# EAGLE design PowerMeter (EAGLE 9.3.0)
DATABASE: ../../../../digikeydb.txt
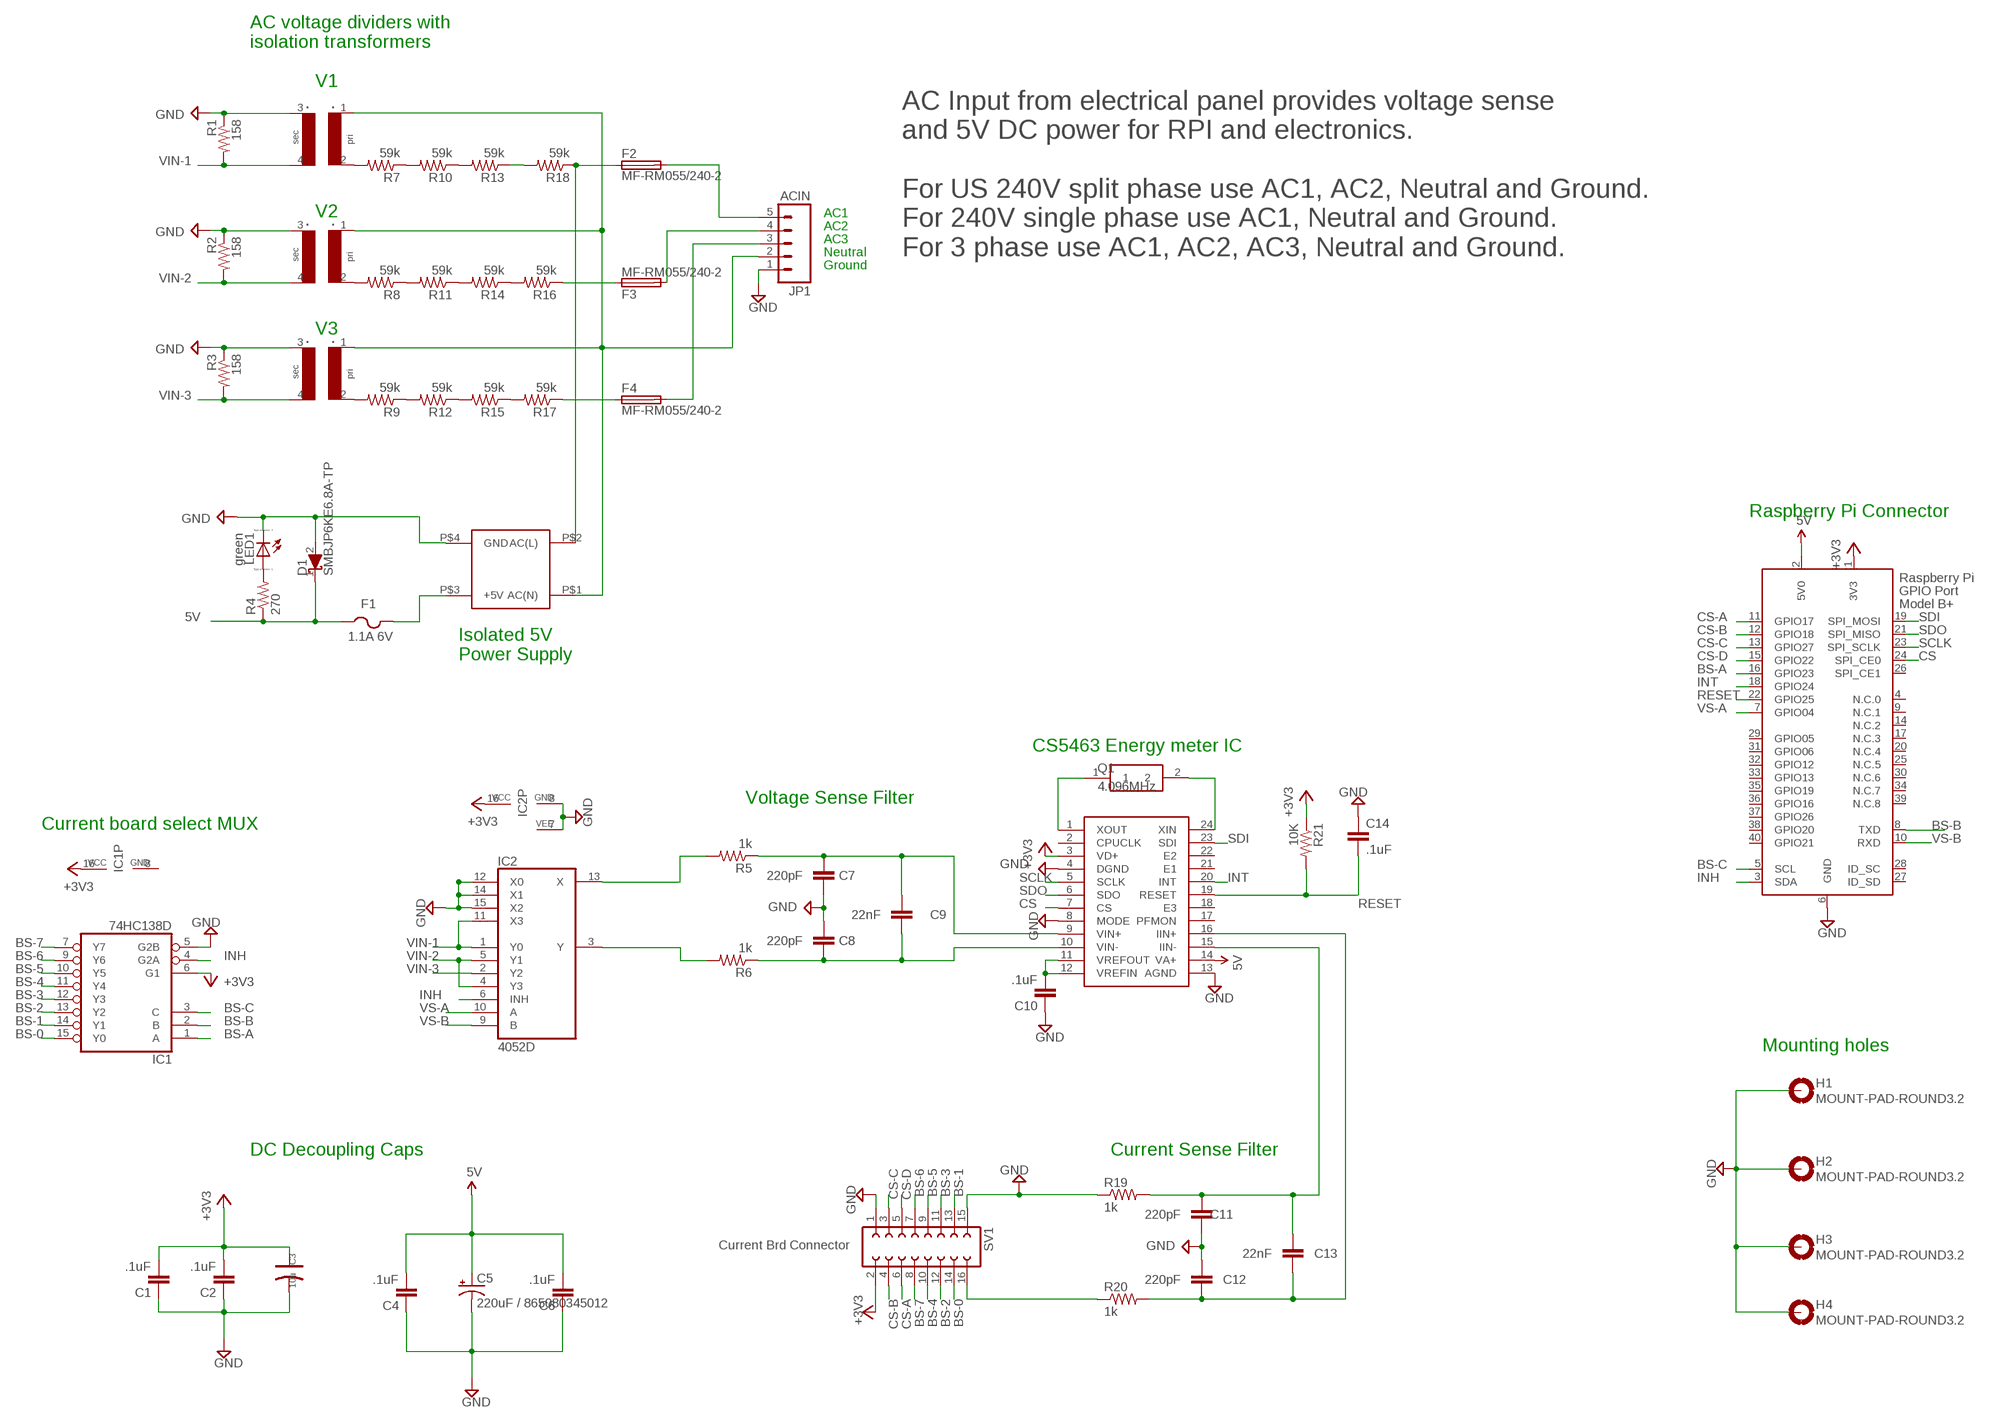
[diagram p0: schematic, sheet 1]

## Parts
C1  .1uF  C-EUC1206  [C1206]
C2  .1uF  C-EUC1206  [C1206]
C3  10u  CAP-AVX-C  [AVX-C]
C4  .1uF  C-EUC1206  [C1206]
C5  220uF / 865080345012  CPOL-USUD-6,3X7,7  [UD-6,3X7,7_NICHICON]
C6  .1uF  C-EUC1206  [C1206]
C7  220pF  C-EUC1206  [C1206]
C8  220pF  C-EUC1206  [C1206]
C9  22nF  C-EUC1206  [C1206]
C10  .1uF  C-EUC1206  [C1206]
C11  220pF  C-EUC1206  [C1206]
C12  220pF  C-EUC1206  [C1206]
C13  22nF  C-EUC1206  [C1206]
C14  .1uF  C-EUC1206  [C1206]
D1  SMBJP6KE6.8A-TP  B340A-13-F  [DIOM5226X240N]
F1  1.1A 6V  PTCFUSE-1812  [1812]
F2  MF-RM055/240-2  FUSETE5  [TE5]
F3  MF-RM055/240-2  FUSETE5  [TE5]
F4  MF-RM055/240-2  FUSETE5  [TE5]
H1  MOUNT-PAD-ROUND3.2  [3,2-PAD]
H2  MOUNT-PAD-ROUND3.2  [3,2-PAD]
H3  MOUNT-PAD-ROUND3.2  [3,2-PAD]
H4  MOUNT-PAD-ROUND3.2  [3,2-PAD]
IC1  74HC138D  [SO16]
IC2  4052D  [SO16]
IC3  CS5463  [SSOP24]
JP1  ACIN  M05  [SCREWTERMINAL-5MM-5]
LED1  green  LED_E  [LED_1206]
PS1  VSK-S10  [VSK-S10]
Q1  4.096MHz  9C-8.000MAAJ-T  [SMD-HC-49-S]
R1  158  R-US_R1206  [R1206]
R2  158  R-US_R1206  [R1206]
R3  158  R-US_R1206  [R1206]
R4  270  R-US_R1206  [R1206]
R5  1k  R-US_R1206  [R1206]
R6  1k  R-US_R1206  [R1206]
R7  59k  R-US_R1206  [R1206]
R8  59k  R-US_R1206  [R1206]
R9  59k  R-US_R1206  [R1206]
R10  59k  R-US_R1206  [R1206]
R11  59k  R-US_R1206  [R1206]
R12  59k  R-US_R1206  [R1206]
R13  59k  R-US_R1206  [R1206]
R14  59k  R-US_R1206  [R1206]
R15  59k  R-US_R1206  [R1206]
R16  59k  R-US_R1206  [R1206]
R17  59k  R-US_R1206  [R1206]
R18  59k  R-US_R1206  [R1206]
R19  1k  R-US_R1206  [R1206]
R20  1k  R-US_R1206  [R1206]
R21  10K  R-US_R1206  [R1206]
SV1  Current Brd Connector  FE08-2  [FE08-2]
T1  TV16E  [TV16E]
T2  TV16E  [TV16E]
T3  TV16E  [TV16E]
X1  RASPI_BOARD_B+_E4  [RASPI_BOARD_B+_EDGES_4DRILL]

## Nets
5V: C4.2 C5.+ C6.2 D1.1(K) F1.1 IC3.14(VA+) R4.1 X1.2(5V0)
+3V3: C1.2 C2.2 C3.+ IC1.6(G1) IC1.16(VCC) IC2.16(VCC) IC3.3(VD+) R21.1 SV1.2 X1.1(3V3)
+5V: F1.2 PS1.P$3(+5V)
AC(L) [ac line]: F2.1 PS1.P$2(AC(L)) R18.1
AC(N) [ac line]: JP1.2 PS1.P$1(AC(N)) T1.1 T2.1 T3.1
BS-0: IC1.15(Y0) SV1.14
BS-1: IC1.14(Y1) SV1.13
BS-2: IC1.13(Y2) SV1.12
BS-3: IC1.12(Y3) SV1.11
BS-4: IC1.11(Y4) SV1.10
BS-5: IC1.10(Y5) SV1.9
BS-6: IC1.9(Y6) SV1.7
BS-7: IC1.7(Y7) SV1.8
BS-A: IC1.1(A) X1.16(GPIO23)
BS-B: IC1.2(B) X1.8(TXD)
BS-C: IC1.3(C) X1.5(SCL)
C5: C12.1 C13.1 IC3.16(IIN+) R20.2
CS: IC3.7(CS) X1.24(SPI_CE0)
CS-A: SV1.6 X1.11(GPIO17)
CS-B: SV1.4 X1.12(GPIO18)
CS-C: SV1.3 X1.13(GPIO27)
CS-D: SV1.5 X1.15(GPIO22)
GND: C1.1 C2.1 C3.- C4.1 C5.- C6.1 C7.1 C8.2 C10.1 C11.1 C12.2 C14.1 D1.2(A) H1.B3,2(MOUNT) H2.B3,2(MOUNT) H3.B3,2(MOUNT) H4.B3,2(MOUNT) IC1.5(G2B) IC2.7(VEE) IC2.8(GND) IC2.12(X0) IC2.14(X1) IC2.15(X2) IC3.4(DGND) IC3.8(MODE) IC3.13(AGND) JP1.1 LED1.C PS1.P$4(GND) R1.1 R2.1 R3.1 R19.1 SV1.1 SV1.15 T1.3 T2.3 T3.3 X1.6(GND)
IIN+: R20.1 SV1.16
INH: IC1.4(G2A) IC2.6(INH) X1.3(SDA)
INT: IC3.20(INT) X1.18(GPIO24)
N$1: IC3.1(XOUT) Q1.1
N$2 [ac line]: F3.1 R16.1
N$3 [ac line]: R7.1 R10.2
N$4 [ac line]: R10.1 R13.2
N$5 [ac line]: F4.2 JP1.3
N$6 [ac line]: R11.1 R14.2
N$7: LED1.A R4.2
N$8: C11.2 C13.2 IC3.15(IIN-) R19.2
N$9 [ac line]: F2.2 JP1.5
N$10 [ac line]: R15.1 R17.2
N$11 [ac line]: R9.2 T3.2
N$12: IC3.24(XIN) Q1.2
N$13 [ac line]: R9.1 R12.2
N$14 [ac line]: R12.1 R15.2
N$15 [ac line]: R8.2 T2.2
N$16 [ac line]: R8.1 R11.2
N$17: C10.2 IC3.11(VREFOUT) IC3.12(VREFIN)
N$18 [ac line]: R14.1 R16.2
N$19 [ac line]: R7.2 T1.2
N$20 [ac line]: R13.1 R18.2
N$21 [ac line]: F4.1 R17.1
N$23: IC2.13(X) R5.2
N$38 [ac line]: F3.2 JP1.4
N$39: IC2.3(Y) R6.2
N$46: C8.1 C9.1 IC3.10(VIN-) R6.1
R1: C7.2 C9.2 IC3.9(VIN+) R5.1
RESET: C14.2 IC3.19(RESET) R21.2 X1.22(GPIO25)
SCLK: IC3.5(SCLK) X1.23(SPI_SCLK)
SDI: IC3.23(SDI) X1.19(SPI_MOSI)
SDO: IC3.6(SDO) X1.21(SPI_MISO)
VIN-1: IC2.1(Y0) IC2.11(X3) R1.2 T1.4
VIN-2: IC2.4(Y3) IC2.5(Y1) R2.2 T2.4
VIN-3: IC2.2(Y2) R3.2 T3.4
VS-A: IC2.10(A) X1.7(GPIO04)
VS-B: IC2.9(B) X1.10(RXD)
Unconnected: IC3.2(CPUCLK) IC3.17(PFMON) IC3.18(E3) IC3.21(E1) IC3.22(E2) X1.4(N.C.0) X1.9(N.C.1) X1.14(N.C.2) X1.17(N.C.3) X1.20(N.C.4) X1.25(N.C.5) X1.26(SPI_CE1) X1.27(ID_SD) X1.28(ID_SC) X1.29(GPIO05) X1.30(N.C.6) X1.31(GPIO06) X1.32(GPIO12) X1.33(GPIO13) X1.34(N.C.7) X1.35(GPIO19) X1.36(GPIO16) X1.37(GPIO26) X1.38(GPIO20) X1.39(N.C.8) X1.40(GPIO21)

## Notes on the sheet
- AC voltage dividers with
  isolation transformers
- V1
- V2 | AC1
- AC2
- AC3
- Neutral
- AC Input from electrical panel provides voltage sense 
  and 5V DC power for RPI and electronics.
  
  For US 240V split phase use AC1, AC2, Neutral and Ground.
  For 240V single phase use AC1, Neutral and Ground.
  For 3 phase use AC1, AC2, AC3, Neutral and Ground.
- Ground
- V3
- Raspberry Pi Connector
- Isolated 5V
  Power Supply
- CS5463 Energy meter IC
- Voltage Sense Filter
- Current board select MUX
- Mounting holes
- DC Decoupling Caps | Current Sense Filter

## Power pins joined to a net without a drawn wire
GND: IC1.8(GND)

## Library data of the parts
C1 C2 C4 C6 C10 C14 = rcl:C-EU: CAPACITOR, European symbol; PARTNO: C1206C104K5RAC7867
C3 = Discrete:CAP*: Electrolytic Capacitors,Tantalum Capacitors and Super Capacitors; PARTNO: T491C106K016AT
C5 = rcl:CPOL-US: POLARIZED CAPACITOR, American symbol; PARTNO: ESH227M016AE3AA; SPICEPREFIX: C
C7 C8 C11 C12 = rcl:C-EU: CAPACITOR, European symbol; PARTNO: C1206C221J5GACTU
C9 C13 = rcl:C-EU: CAPACITOR, European symbol; PARTNO: C1206C223K5RACTU
D1 = SamacSys_Parts:B340A-13-F: Schottky Diode 3A 40V 0.5Vf SMA Diodes Inc B340A-13-F, SMT Schottky Diode, 40V 3A, 2-Pin DO-214AC Source: Datasheet <http://www.diodes.com/_files/datasheets/ds30891.pdf>; ALLIED_NUMBER: 70437566; ALLIED_PRICE-STOCK: http://www.alliedelec.com/diodes-inc-b340a-13-f/70437566/; DESCRIPTION: Schottky Diode 3A 40V 0.5Vf SMA Diodes Inc B340A-13-F, SMT Schottky Diode, 40V 3A, 2-Pin DO-214AC; HEIGHT: 2.4mm; MANUFACTURER_NAME: Diodes Inc.; MANUFACTURER_PART_NUMBER: B340A-13-F; MOUSER_PART_NUMBER: 621-B340A-F; MOUSER_PRICE-STOCK: https://www.mouser.com/Search/Refine.aspx?Keyword=621-B340A-F; RS_PART_NUMBER: 7384778P; RS_PRICE-STOCK: http://uk.rs-online.com/web/p/products/7384778P
F1 = adafruit:PTCFUSE: PTC fuses, resettable thermistors; PARTNO: 0ZCC0110AF2C
F2-F4 = fuse:FUSE: Fuse; OC_FARNELL: unknown; OC_NEWARK: unknown; PARTNO: MF-RM055/240-2
H1-H4 = holes:MOUNT-PAD-ROUND: MOUNTING PAD, round; BOM: EXCLUDE
IC1 = 74xx-eu:74*138: 3-line to 8-line DECODER/DEMULTIPLEXER; PARTNO: SN74HC138NSR
IC2 = 40xx:4052: Dual 4-channel ANALOG MULTIPLEXER; PARTNO: CD4052BNSR
IC3 = Cirrus_Logic_By_element14_Batch_1:CS5463; PARTNO: CS5463-ISZ
JP1 = SparkFun-Connectors:M05: Header 5 Standard 5-pin 0.1" header. Use with straight break away headers (SKU : PRT-00116), right angle break away headers (PRT-00553), swiss pins (PRT-00743), machine pins (PRT-00117), and female headers (PRT-00115). Molex polarized connector foot print use with SKU : PRT-08230 with associated crimp pins and housings.; PARTNO: 1935190
LED1 = eagle-ltspice:LED_E: LED Source: http://www.osram.convergy.de Source: www.luxeon.com Source: www.kingbright.com; PARTNO: LTST-C150GKT; SPICEMODEL: NONE; SPICEPREFIX: D; SPICETYPE: diode
PS1 = CraigJensen:VSK-S10; PARTNO: VSK-S5-5UA
Q1 = SamacSys_Parts:9C-8.000MAAJ-T: TXC - 9C-8.000MAAJ-T - XTAL, 8.000MHZ, 18PF, SMD, HC-49S Source: Datasheet <http://www.txccrystal.com/images/pdf/9c.pdf>; DESCRIPTION: TXC - 9C-8.000MAAJ-T - XTAL, 8.000MHZ, 18PF, SMD, HC-49S; HEIGHT: mm; MANUFACTURER_NAME: TXC; MANUFACTURER_PART_NUMBER: 9C-8.000MAAJ-T; MOUSER_PART_NUMBER: 717-9C-8.000MAAJ-T; MOUSER_PRICE-STOCK: https://www.mouser.com/Search/Refine.aspx?Keyword=717-9C-8.000MAAJ-T; PARTNO: 9B-4.096MBBK-B
R1-R3 = resistor:R-US_: RESISTOR, American symbol; PARTNO: RC1206FR-07158RL
R4 = resistor:R-US_: RESISTOR, American symbol; PARTNO: RC1206FR-07270RL
R5-R20 = resistor:R-US_: RESISTOR, American symbol; PARTNO: RC1206FR-071KL
R21 = resistor:R-US_: RESISTOR, American symbol; PARTNO: RC1206FR-0710KL
SV1 = con-lsta:FE08-2: FEMALE HEADER; OC_FARNELL: unknown; OC_NEWARK: unknown; PARTNO: PPTC082LFBN-RC
T1-T3 = CraigJensen:TV16E: YHDC TV16E Transformer
X1 = raspberrypi_bastelstube_v13:RASPI_BOARD_B+: Raspberry Pi GPIO connector with markings for the outer dimensions of the Raspberry Pi board model B+ with different sets of drill holes or mounting pads; PARTNO: M20-9762046

## Net classes
1 ac line: width 0.4 mm, clearance 1.2 mm

## Board
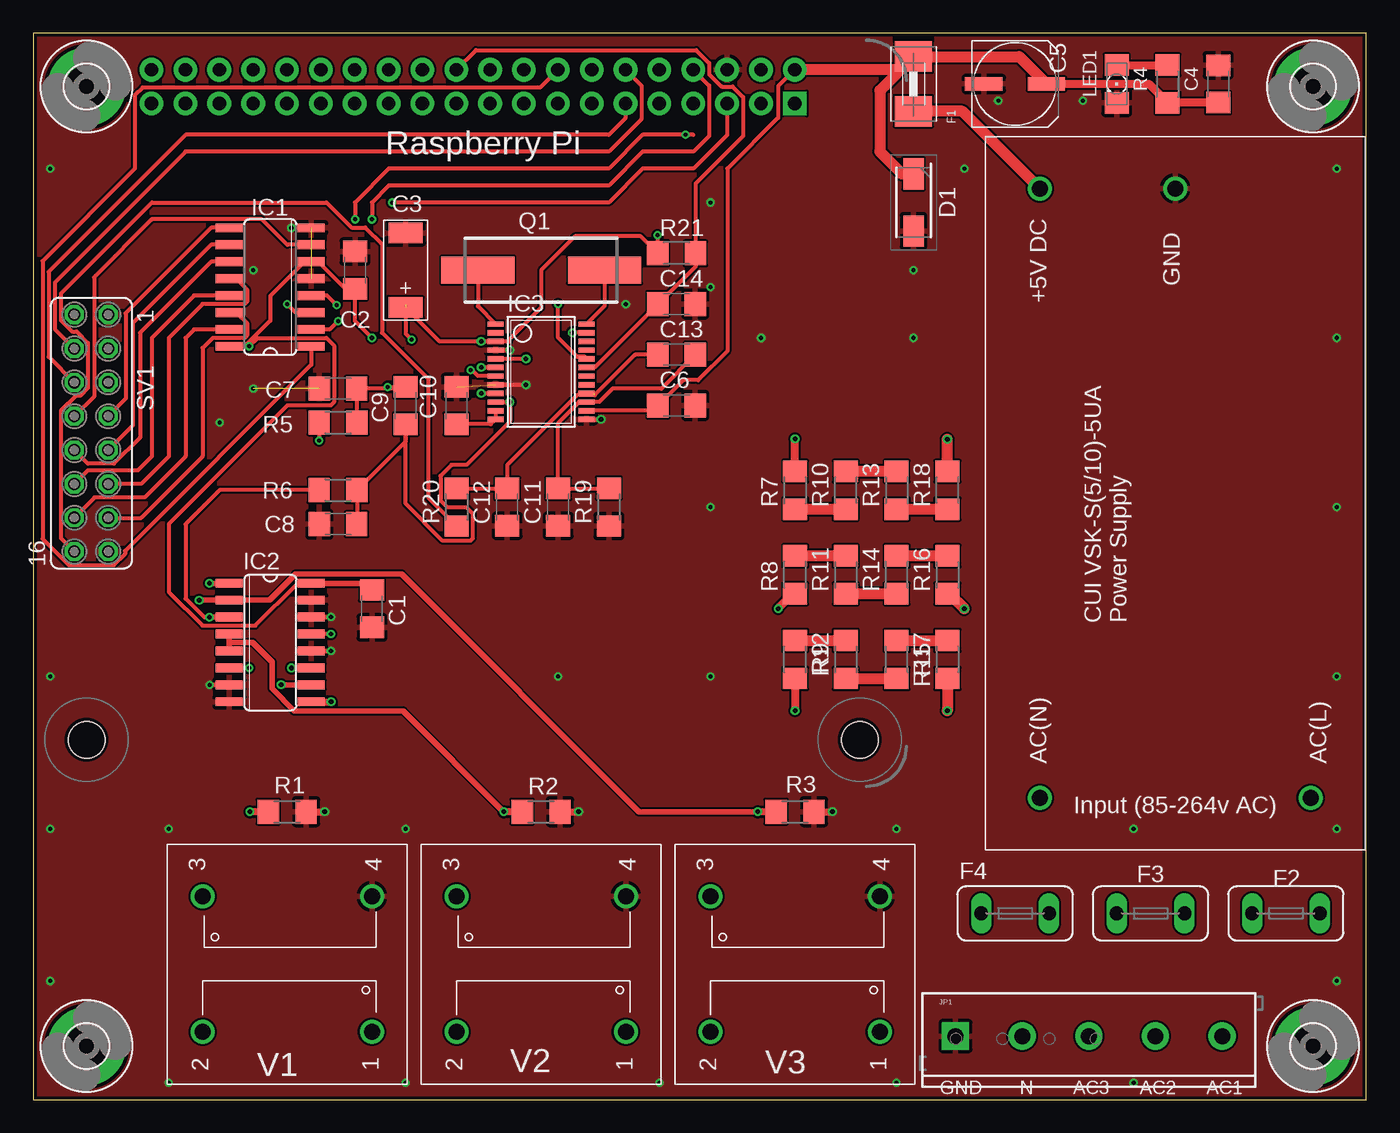
[diagram p1: board, top side]
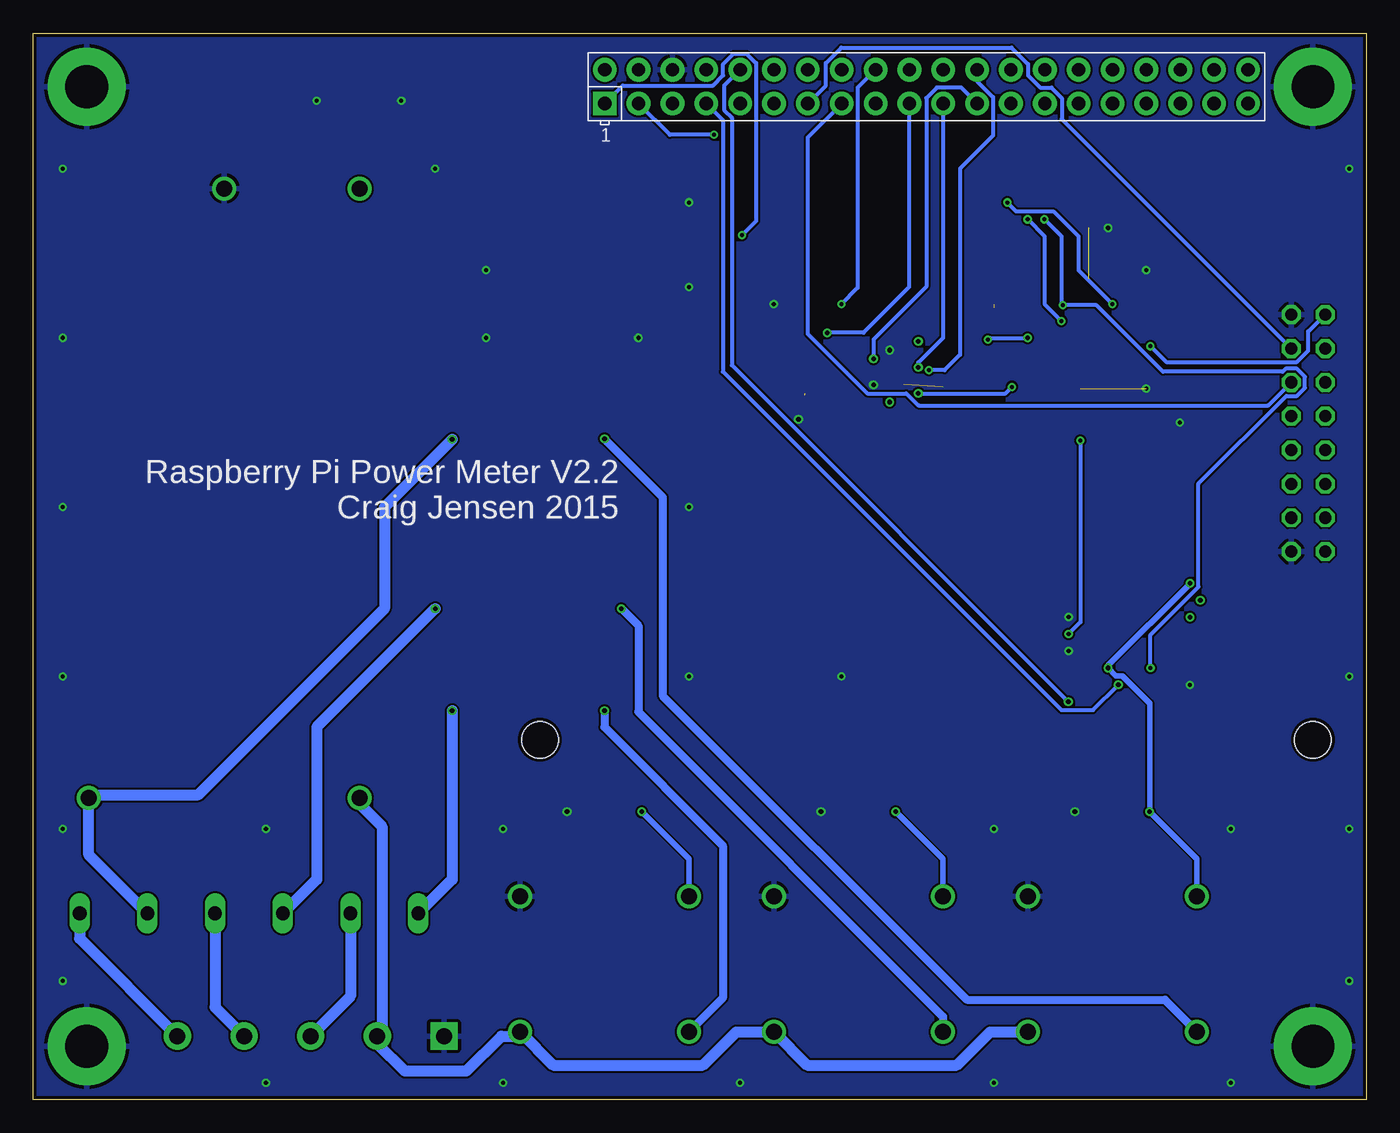
[diagram p2: board, bottom side, seen from below]

Size 100 x 80 mm. Coordinates in mm from the lower left corner, seen from the top.
Outline: 0,0 100,0 100,80 0,80 0,0
Copper layers (1*16): Top 0.035mm / dielectric 1.5mm / Bottom 0.035mm
Design rules "Elecrow_2-layer_eagle_rule": minimum track width 6mil, minimum drill 12mil, track to track 6mil, track to pad 6mil, pad to pad 6mil, via to via 6mil, smd to smd 0mil, copper to edge 10mil, drill to drill 10mil, minimum pad ring 10mil, minimum via ring 6mil, stop-mask expansion 2mil, vias tented up to drill 100mil, thermal gap 10mil

### Footprints (pad centres in the part's own frame; a part is rotated, then mirrored left to right if it is on the bottom)
C1206 = smd 1.6 x 1.8: 1 -1.4,0; 2 1.4,0
AVX-C = smd 1.524 x 2.54: + -2.794,0; - 2.794,0
UD-6,3X7,7_NICHICON = smd 2.8 x 1: + 2.35,0; - -2.35,0
DIOM5226X240N = smd 2.35 x 1.55: 1 -2.15,0; 2 2.15,0
1812 = smd 2.286 x 2.794: 1 -2.046,0; 2 2.046,0
TE5 = drill 1.016 long: 1 -2.54,0; 2 2.54,0
3,2-PAD = drill 3.2 pad 5.842: B3,2 0,0
SO16 = smd 0.66 x 2.032: 1 -4.445,-3.073; 2 -3.175,-3.073; 3 -1.905,-3.073; 4 -0.635,-3.073; 5 0.635,-3.073; 6 1.905,-3.073; 7 3.175,-3.073; 8 4.445,-3.073; 9 4.445,3.073; 10 3.175,3.073; 11 1.905,3.073; 12 0.635,3.073; 13 -0.635,3.073; 14 -1.905,3.073; 15 -3.175,3.073; 16 -4.445,3.073
SSOP24 = smd 0.4 x 1.2: 1 -3.575,-3.42; 2 -2.925,-3.42; 3 -2.275,-3.42; 4 -1.625,-3.42; 5 -0.975,-3.42; 6 -0.325,-3.42; 7 0.325,-3.42; 8 0.975,-3.42; 9 1.625,-3.42; 10 2.275,-3.42; 11 2.925,-3.42; 12 3.575,-3.42; 13 3.575,3.42; 14 2.925,3.42; 15 2.275,3.42; 16 1.625,3.42; 17 0.975,3.42; 18 0.325,3.42; 19 -0.325,3.42; 20 -0.975,3.42; 21 -1.625,3.42; 22 -2.275,3.42; 23 -2.925,3.42; 24 -3.575,3.42
SCREWTERMINAL-5MM-5 = drill 1.2 pad 2.032 square: 1 2.53,4.46 | drill 1.2 pad 2.032: 2 7.53,4.46; 3 12.53,4.46; 4 17.53,4.46; 5 22.53,4.46
LED_1206 = smd 1.6 x 1.803: A -1.422,0; C 1.422,0
VSK-S10 = drill 1.2: P$1 -22.86,10.16; P$2 -22.86,-10.16; P$3 22.86,10.16; P$4 22.86,0
SMD-HC-49-S = smd 5.5 x 2: 1 -4.75,0; 2 4.75,0
R1206 = smd 1.6 x 1.803: 1 -1.422,0; 2 1.422,0
FE08-2 = drill 0.914 octagon: 1 -8.89,1.27; 2 -8.89,-1.27; 3 -6.35,1.27; 4 -6.35,-1.27; 5 -3.81,1.27; 6 -3.81,-1.27; 7 -1.27,1.27; 8 -1.27,-1.27; 9 1.27,1.27; 10 1.27,-1.27; 11 3.81,1.27; 12 3.81,-1.27; 13 6.35,1.27; 14 6.35,-1.27; 15 8.89,1.27; 16 8.89,-1.27
TV16E = drill 1.2: 1 -5.08,-6.35; 2 -5.08,6.35; 3 5.08,-6.35; 4 5.08,6.35
RASPI_BOARD_B+_EDGES_4DRILL = drill 1 pad 1.778 square: 1 8.37,51.23 | drill 1 pad 1.778: 2 8.37,53.77; 3 10.91,51.23; 4 10.91,53.77; 5 13.45,51.23; 6 13.45,53.77; 7 15.99,51.23; 8 15.99,53.77; 9 18.53,51.23; 10 18.53,53.77; 11 21.07,51.23; 12 21.07,53.77; 13 23.61,51.23; 14 23.61,53.77; 15 26.15,51.23; 16 26.15,53.77; 17 28.69,51.23; 18 28.69,53.77; 19 31.23,51.23; 20 31.23,53.77; 21 33.77,51.23; 22 33.77,53.77; 23 36.31,51.23; 24 36.31,53.77; 25 38.85,51.23; 26 38.85,53.77; 27 41.39,51.23; 28 41.39,53.77; 29 43.93,51.23; 30 43.93,53.77; 31 46.47,51.23; 32 46.47,53.77; 33 49.01,51.23; 34 49.01,53.77; 35 51.55,51.23; 36 51.55,53.77; 37 54.09,51.23; 38 54.09,53.77; 39 56.63,51.23; 40 56.63,53.77 | hole 2.75: 61.5,3.5; 3.5,3.5

### Placement (x,y rotation side)
C1  25.4,36.83 90 top
C2  24.13,62.23 270 top
C3  27.94,62.23 90 top
C4  88.9,76.2 270 top
C5  73.66,76.2 0 top
C6  48.26,52.07 180 top
C7  22.86,53.34 0 top
C8  22.86,43.18 180 top
C9  27.94,52.07 90 top
C10  31.75,52.07 270 top
C11  39.37,44.45 90 top
C12  35.56,44.45 270 top
C13  48.26,55.88 0 top
C14  48.26,59.69 180 top
D1  66.04,67.31 270 top
F1  66.04,76.2 270 top
F2  93.98,13.97 0 top
F3  83.82,13.97 0 top
F4  73.66,13.97 0 top
H1  96,76 0 top
H2  96,4 0 top
H3  4,4 0 top
H4  4,76 0 top
IC1  17.78,60.96 90 top
IC2  17.78,34.29 270 top
IC3  38.1,54.61 270 top
JP1  66.66,0.3 0 top
LED1  81.28,76.2 270 top
PS1  85.67,45.5 90 top
Q1  38.1,62.23 0 top
R1  19.05,21.59 180 top
R2  38.1,21.59 180 top
R3  57.15,21.59 180 top
R4  85.09,76.2 90 top
R5  22.86,50.8 180 top
R6  22.86,45.72 180 top
R7  57.15,45.72 90 top
R8  57.15,39.37 270 top
R9  57.15,33.02 270 top
R10  60.96,45.72 270 top
R11  60.96,39.37 90 top
R12  60.96,33.02 90 top
R13  64.77,45.72 90 top
R14  64.77,39.37 270 top
R15  64.77,33.02 270 top
R16  68.58,39.37 90 top
R17  68.58,33.02 90 top
R18  68.58,45.72 270 top
R19  43.18,44.45 90 top
R20  31.75,44.45 90 top
R21  48.26,63.5 0 top
SV1  4.35,50 270 top
T1  19.05,10.16 90 top
T2  38.1,10.16 90 top
T3  57.15,10.16 90 top
X1  65.5,23.5 0 bottom

### Tracks (layer width: path | path; a pad name or v marks a point on that pad's centre or on a via)
5V
  Top 0.305: IC3.14 46.48,51.69 C6.2 48.77,53.98 49.89,53.98 52.07,56.16 52.07,69.85 55.88,73.66 55.88,76.02 X1.2
  Top 0.61: C4.2 85.11,74.8 | 85.11,74.8 R4.1 | 57.13,76.71 X1.2 57.13,77.16 | F1.1 65.98,78.35 | C5.+ 83.71,76.2 85.11,74.8
  Top 0.813: F1.1 63.5,75.71 63.5,71.12 65.16,69.46 D1.1 | F1.1 65.06,77.27 X1.2 | F1.1 73.96,78.25 C5.+
+3V3  (via drill 0.3, 0.35)  (1 unrouted)
  Top 0.305: C3.+ 30.49,56.88 v33.6,56.88 IC3.3 34.7,56.87 35.56,56.87 | 27.94,59.63 27.94,57.45 v28.37,57.02 | v25.4,57.15 24.13,58.42 C2.2 23.4,60.83 21.36,62.87 IC1.6 20.35,62.87 17.78,60.3 17.78,58.44 15.86,56.52 IC1.16 v16.18,56.52 16.82,57.15 22,57.15 22.57,56.58 22.57,52.31 22.32,52.07 19.05,52.07 10.16,43.18 10.16,38.1 12.7,35.56 16.66,35.56 19.84,38.73 IC2.16 | v46.84,64.86 R21.1 45.57,64.77 40.64,64.77 38.1,62.23 38.1,59.41 35.56,56.87 | 35.69,56.87 35.56,56.87
  Top 0.406: IC2.16 24.89,38.73 C1.2
  Bottom 0.305: v28.37,57.02 28.25,57.15 v25.4,57.15 | v16.18,56.52 15,55.33 5.2,55.33 4.35,56.18 4.35,57.62 SV1.2 | X1.1 55.78,76.08 49.02,76.08 48.24,76.85 48.24,77.69 47.46,78.46 46.48,78.46 45.78,77.76 45.78,65.92 v46.84,64.86
+5V
  Top 0.813: PS1.P$3 69.71,74.15 F1.2
AC(L)  (via drill 0.35)
  Top 0.813: R18.1 v68.58,49.53
  Bottom 0.813: F2.1 95.83,18.36 PS1.P$2 95.61,22.86 87.63,22.86 73.66,36.83 73.66,44.45 v68.58,49.53
AC(N)
  Bottom 0.813: PS1.P$1 75.5,22.16 73.83,20.49 73.83,5.12 JP1.2 74.19,4.19 72.14,2.14 67.51,2.14 64.89,4.76 63.82,4.76 T3.1 60.99,2.57 49.76,2.57 47.26,5.08 T2.1 41.94,2.57 30.71,2.57 28.2,5.08 T1.1
BS-0
  Top 0.305: IC1.15 12.06,57.78 11.43,57.15 11.43,48.26 8.34,45.17 4.6,45.17 SV1.14
BS-1
  Top 0.305: IC1.14 15.21,59.05 16.03,58.24 16.03,57.33 15.85,57.15 13.46,57.15 12.7,56.39 12.7,48.26 8.09,43.65 SV1.13
BS-2
  Top 0.305: IC1.13 12.06,60.33 8.89,57.15 8.89,48.26 7.84,47.21 4.1,47.21 SV1.12
BS-3
  Top 0.305: IC1.12 15.21,61.59 16.03,60.78 16.03,59.87 15.85,59.69 12.7,59.69 10.16,57.15 10.16,48.26 8.09,46.19 SV1.11
BS-4
  Top 0.305: IC1.11 13.34,62.87 8.01,57.54 8.01,49.69 6.04,47.71 4.1,47.71 SV1.10
BS-5
  Top 0.305: IC1.10 13.34,64.14 7.47,58.27 7.47,50.58 SV1.9
BS-6
  Top 0.305: IC1.9 13.34,65.41 6.92,58.99 6.92,52.58 SV1.7
BS-7
  Top 0.305: IC1.7 19.05,64.14 17.15,66.04 8.89,66.04 4.55,61.7 4.55,52.74 SV1.8
BS-A
  Top 0.305: X1.16 38,75.92 8.2,75.92 7.62,75.35 7.62,69.85 0.69,62.92 0.69,42.06 2.66,40.09 6.04,40.09 6.88,40.94 6.88,41.17 20.85,55.14 IC1.1
BS-B  (via drill 0.3)
  Top 0.305: v25.4,66.04 25.4,67.31 26.67,68.58 43.18,68.58 45.72,71.12 49.53,71.12 50.7,72.29 50.7,76.08 X1.8 | v22.86,58.42 22.23,57.78 IC1.2
  Bottom 0.305: v22.86,58.42 24.13,59.69 24.13,64.77 v25.4,66.04
BS-C  (via drill 0.3)
  Top 0.305: v26.92,67.31 43.18,67.31 45.72,69.85 49.53,69.85 52.05,72.37 X1.5 | v19.05,59.69 19.68,59.05 IC1.3
  Bottom 0.305: v19.05,59.69 21.59,62.23 21.59,64.77 23.47,66.65 26.26,66.65 v26.92,67.31
C5  (1 unrouted)
  Top 0.305: 42.1,52.98 IC3.16 | R20.2 31.77,45.85 C12.1 35.56,47.61 40.79,52.84 42.12,52.84 45.16,55.88 C13.1
CS  (via drill 0.3)
  Top 0.305: v32.82,54.73 32.91,54.73 33.34,54.3 34.66,54.3 IC3.7
  Bottom 0.305: X1.24 29.19,76.42 28,75.22 28,72.33 30.48,69.85 30.48,55.88 31.63,54.73 v32.82,54.73
CS-A
  Top 0.305: X1.11 44.43,73.64 43.18,72.39 11.43,72.39 1.15,62.11 1.15,55.74 SV1.6
CS-B
  Top 0.305: X1.12 45.62,76.08 45.62,73.56 43.18,71.12 11.43,71.12 1.61,61.3 1.61,57.82 SV1.4
CS-C
  Bottom 0.305: X1.13 40.54,76.08 40.54,77.76 39.39,78.92 26.61,78.92 25.38,77.69 25.38,76.85 24.45,75.92 23.61,75.92 22.84,75.15 22.84,73.57 SV1.3
CS-D
  Bottom 0.305: X1.15 41.91,72.17 41.91,57.46 37.43,52.98 34.49,52.98 33.58,52.07 7.36,52.07 SV1.5
GND  (via drill 0.3, 0.35)  (3 unrouted)
  Top 0.305: IC3.13 v42.6,51.03 | IC3.4 v35.76,56.23 | IC3.8 v36.96,53.63 | IC1.8 v19.36,65.41 | IC2.7 v13.23,31.11 | IC2.14 v22.33,36.2 | IC2.12 v22.33,33.66
  Top 0.508: R2.1 v40.9,21.59 | R3.1 v59.95,21.59 | R1.1 v21.85,21.59
  other vias: 44.45,59.69 1.27,69.85 16.51,53.34 69.85,69.85 66.04,57.15 54.61,57.15 10.16,20.32 27.94,20.32 64.77,20.32 10.16,1.27 27.94,1.27 46.99,1.27 64.77,1.27 1.27,31.75 1.27,20.32 1.27,8.89 97.79,8.89 97.79,20.32 97.79,31.75 97.79,69.85 97.79,44.45 97.79,57.15 13.97,50.8 39.37,31.75 50.8,31.75 50.8,44.45 82.55,20.32 82.55,1.27 16.51,62.23 50.8,67.31 50.8,60.96 72.39,74.93 78.74,74.93 66.04,62.23
  pour Bottom: 101.38,81.12 101.86,-1 -1.12,-0.88 -1,34 -0.88,81.12
  pour Top: 101.38,81.25 101.31,-1 -2,-0.75 -2,81.25
IIN+
  Top 0.305: R20.1 29.66,45.12 29.66,54.04 26.16,57.54 26.16,64.17 24.9,65.43 23.88,65.43 22,67.31 8.89,67.31 2.06,60.48 2.06,58.47 2.91,57.62 3.25,57.62 4.1,56.77 4.1,53.39 3.5,52.79 3.17,52.79 2.06,51.69 2.06,42.13 SV1.16
INH  (via drill 0.3)
  Top 0.305: IC2.6 v16.18,32.38 | v22.77,59.6 22.04,60.33 IC1.4 | v24.13,66.04 24.13,67.31 26.67,69.85 43.18,69.85 45.72,72.39 v48.92,72.39 49.53,72.39
  Bottom 0.305: v16.18,32.38 16.18,34.87 12.58,38.47 12.58,46.2 5.99,52.79 5.2,52.79 4.6,53.39 4.6,54.23 5.2,54.83 6.04,54.83 6.26,54.61 15.24,54.61 20.23,59.6 v22.77,59.6 22.86,59.69 22.86,64.77 v24.13,66.04 | X1.3 52.25,72.39 v48.92,72.39
INT  (via drill 0.3)
  Top 0.305: IC3.20 41.38,55.73 40.79,55.73 39.37,57.15 v39.37,59.69
  Bottom 0.305: v39.37,59.69 38.16,60.9 38.16,75.92 X1.18
N$1
  Top 0.305: Q1.1 33.35,59.52 IC3.1
N$2  (via drill 0.35)
  Top 0.61: R16.1 68.73,37.95
  Top 0.813: 68.73,37.95 v69.85,36.83
  Bottom 0.813: v69.85,36.83 78.74,27.94 78.74,16.51 F3.1
N$3
  Top 0.813: R7.1 R10.2
N$4
  Top 0.813: R10.1 R13.2
N$5
  Bottom 0.813: F4.2 76.2,7.75 JP1.3
N$6
  Top 0.813: R14.2 R11.1
N$7
  Top 0.61: LED1.A R4.2
N$8
  Top 0.305: R19.2 43.16,45.85 C11.2 39.37,50.77 40.94,52.34 IC3.15 42.45,52.34 43.46,53.34 47.12,53.34 C13.2
N$9
  Bottom 0.813: F2.2 96.52,12.09 JP1.5
N$10
  Top 0.813: R15.1 R17.2
N$11  (via drill 0.35)
  Top 0.61: R9.2 v57.15,29.17
  Bottom 0.61: v57.15,29.17 57.15,27.94 48.26,19.05 48.26,7.62 T3.2
N$12
  Top 0.305: Q1.2 42.85,59.52 IC3.24
N$13
  Top 0.813: R9.1 R12.2
N$14
  Top 0.813: R12.1 R15.2
N$15  (via drill 0.35)
  Top 0.61: R8.2 57,37.95 v55.88,36.83
  Bottom 0.61: v55.88,36.83 54.61,35.56 54.61,29.08 31.75,6.22 T2.2
N$16
  Top 0.813: R11.2 R8.1
N$17
  Top 0.305: IC3.11 IC3.12 34.31,50.67 C10.2
N$18
  Top 0.813: R16.2 R14.1
N$19  (via drill 0.35)
  Top 0.61: R7.2 v57.15,49.57
  Bottom 0.61: v57.15,49.57 52.78,45.2 52.78,30.3 29.96,7.49 15.11,7.49 T1.2
N$20
  Top 0.813: R13.1 R18.2
N$21  (via drill 0.35)
  Top 0.813: R17.1 v68.58,29.17
  Bottom 0.813: v68.58,29.17 68.58,16.51 F4.1
N$23  (via drill 0.3)
  Top 0.305: R5.2 v21.44,49.44 | v22.33,34.92 IC2.13
  Bottom 0.305: v21.44,49.44 21.44,35.81 v22.33,34.92
N$38
  Bottom 0.813: F3.2 86.36,6.93 JP1.4
N$39  (via drill 0.35)
  Top 0.305: R6.2 13.97,45.72 11.43,43.18 11.43,37.59 12.82,36.2 IC2.3
  Top 0.406: IC2.3 v13.21,36.2
N$46  (via drill 0.35)
  Top 0.305: IC3.10 v35.76,52.34 35.76,50.88 32.49,47.62 31.36,47.62 30.54,46.8 30.54,44.95 31.04,44.45 32.46,44.45 32.96,43.95 32.96,42.1 32.78,41.92 30.72,41.92 27.94,44.7 C9.1 27.94,49.38 R6.1 24.28,43.2 C8.1
R1  (via drill 0.3, 0.35)
  Top 0.305: IC3.9 v33.6,52.98 | R5.1 24.26,50.82 C7.2 27.81,53.34 C9.2 v26.58,53.47
  Bottom 0.305: v33.6,52.98 27.07,52.98 v26.58,53.47
RESET
  Top 0.305: IC3.19 42.1,54.94 C14.2 49.68,62.51 R21.2 49.68,68.73 53.24,72.29 53.24,75.22 52.47,76 51.63,76 50.7,76.93 50.7,77.77 49.73,78.74 33.2,78.74 X1.22
SCLK  (via drill 0.35)
  Top 0.305: IC3.5 v36.96,55.59
  Bottom 0.305: X1.23 30.38,75.92 32.22,75.92 33,75.15 33,60.98 36.96,57.02 v36.96,55.59
SDI  (via drill 0.35)
  Top 0.305: IC3.23 v40.44,57.53
  Bottom 0.305: X1.19 34.29,74.71 34.29,60.96 37.72,57.53 v40.44,57.53
SDO  (via drill 0.35)
  Top 0.305: IC3.6 v33.6,54.94
  Bottom 0.305: X1.21 31.75,74.71 31.75,57.15 33.6,55.3 v33.6,54.94
VIN-1  (via drill 0.35)
  Top 0.406: IC2.1 v13.21,38.73 | IC2.11 v19.36,32.38
  Top 0.508: R1.2 v16.25,21.59
  Bottom 0.406: T1.4 12.7,18.04 v16.25,21.59 16.25,29.74 18.31,31.8 18.77,31.8 v19.36,32.38 19.36,32.59 v13.21,38.73
VIN-2  (via drill 0.35)
  Top 0.305: IC2.5 14.71,34.29 IC2.4
  Top 0.406: v35.3,21.59 27.73,29.16 19.58,29.16 17.91,30.83 17.91,32.84 16.46,34.29 14.71,34.29 | IC2.4 IC2.5
  Top 0.508: R2.2 v35.3,21.59
  Bottom 0.406: v35.3,21.59 31.75,18.04 T2.4
VIN-3  (via drill 0.35)
  Top 0.406: IC2.2 v12.44,37.47 17.73,37.47 19.69,39.42 27.63,39.42 45.46,21.59 v54.35,21.59
  Top 0.508: R3.2 v54.35,21.59
  Bottom 0.406: v54.35,21.59 50.8,18.04 T3.4
VS-A  (via drill 0.35)
  Top 0.406: IC2.10 v18.59,31.11
  Bottom 0.305: X1.7 48.26,73.48 48.26,54.61 22.86,29.21 20.49,29.21 v18.59,31.11
VS-B  (via drill 0.35)
  Top 0.508: IC2.9 v22.35,29.84
  Bottom 0.305: X1.10 48.16,76.08 48.16,74.23 47.6,73.67 47.6,55.09 v22.35,29.84

### Text on the board
tNames: Raspberry Pi | V1 | V2 | V3 | GND | N | AC3 | AC2 | AC1
bNames: Raspberry Pi Power Meter V2.2 / Craig Jensen 2015